# EAGLE design E-Book Wing Rev A (EAGLE 9.4.2)
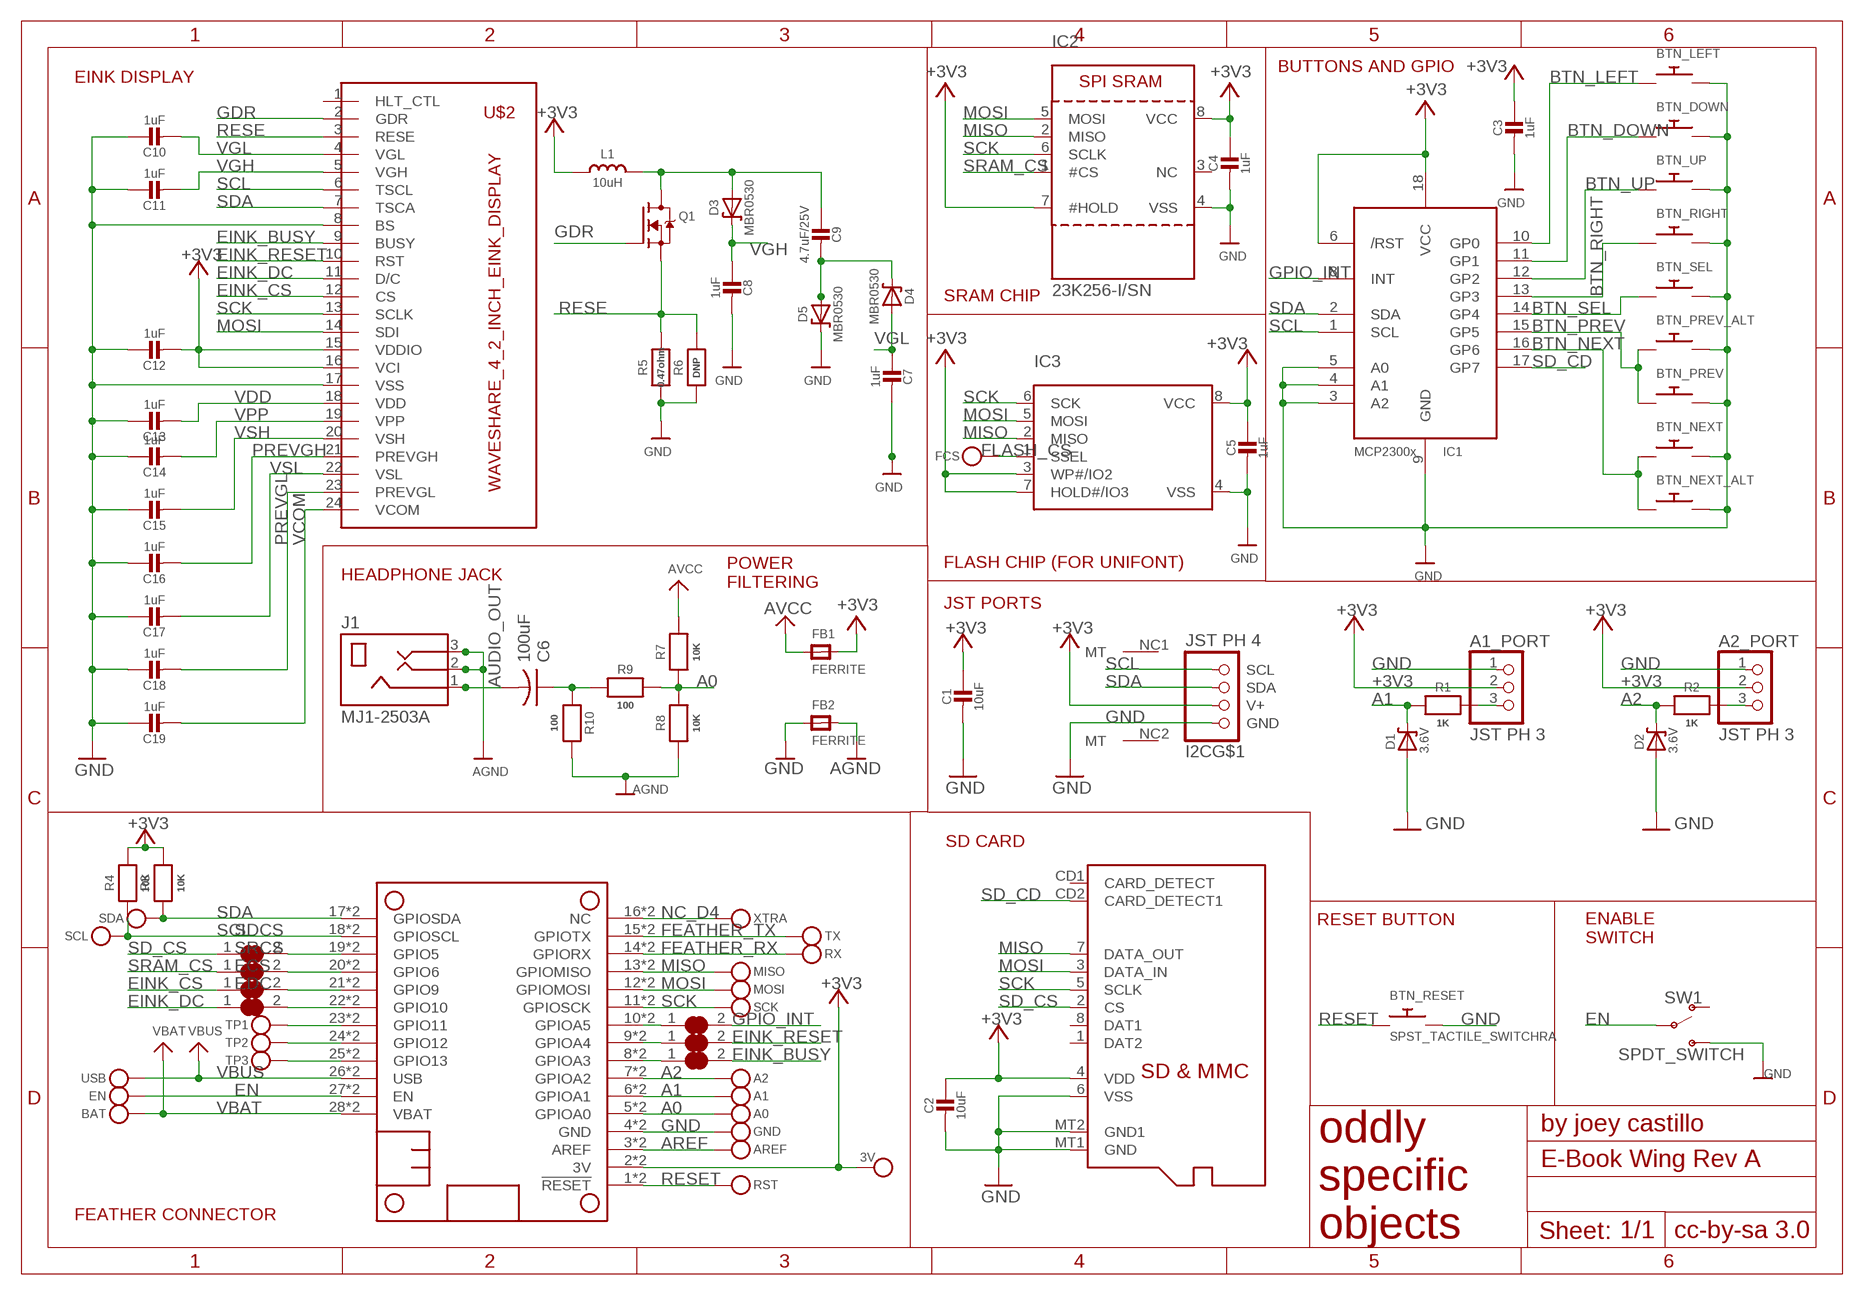
[diagram p0: schematic, sheet 1]

## Parts
3V  MICROBUILDER_TESTPOINT1.5X2.0MM_NOCREAM  [MICROBUILDER_PAD-1.5X2.0]
A0  MICROBUILDER_TESTPOINT1.5X2.0MM_NOCREAM  [MICROBUILDER_PAD-1.5X2.0]
A1  MICROBUILDER_TESTPOINT1.5X2.0MM_NOCREAM  [MICROBUILDER_PAD-1.5X2.0]
A1_PORT  JST PH 3  CON_JST_PH_3PIN  [JSTPH3]
A2  MICROBUILDER_TESTPOINT1.5X2.0MM_NOCREAM  [MICROBUILDER_PAD-1.5X2.0]
A2_PORT  JST PH 3  CON_JST_PH_3PIN  [JSTPH3]
AREF  MICROBUILDER_TESTPOINT1.5X2.0MM_NOCREAM  [MICROBUILDER_PAD-1.5X2.0]
BAT  MICROBUILDER_TESTPOINT1.5X2.0MM_NOCREAM  [MICROBUILDER_PAD-1.5X2.0]
BTN_DOWN  MJTP1250_SPST_SWITCH  [MJTP1250]
BTN_LEFT  MJTP1250_SPST_SWITCH  [MJTP1250]
BTN_NEXT  MJTP1250_SPST_SWITCH  [MJTP1250]
BTN_NEXT_ALT  SPST_TACTILE_SWITCHRA  [TL3330AF130QG]
BTN_PREV  MJTP1250_SPST_SWITCH  [MJTP1250]
BTN_PREV_ALT  SPST_TACTILE_SWITCHRA  [TL3330AF130QG]
BTN_RESET  SPST_TACTILE_SWITCHRA  [TL3330AF130QG]
BTN_RIGHT  MJTP1250_SPST_SWITCH  [MJTP1250]
BTN_SEL  MJTP1250_SPST_SWITCH  [MJTP1250]
BTN_UP  MJTP1250_SPST_SWITCH  [MJTP1250]
C1  10uF  CAP_CERAMIC0805-NOOUTLINE  [0805-NO]
C2  10uF  CAP_CERAMIC0805_10MGAP  [0805_10MGAP]
C3  1uF  CAP_CERAMIC0805_10MGAP  [0805_10MGAP]
C4  1uF  CAP_CERAMIC0805_10MGAP  [0805_10MGAP]
C5  1uF  CAP_CERAMIC0805_10MGAP  [0805_10MGAP]
C6  100uF  C-USC1210  [C1210]
C7  1uF  CAP_CERAMIC0805-NOOUTLINE  [0805-NO]
C8  1uF  CAP_CERAMIC0805-NOOUTLINE  [0805-NO]
C9  4.7uF/25V  CAP_CERAMIC0805-NOOUTLINE  [0805-NO]
C10  1uF  CAP_CERAMIC0805-NOOUTLINE  [0805-NO]
C11  1uF  CAP_CERAMIC0805-NOOUTLINE  [0805-NO]
C12  1uF  CAP_CERAMIC0805-NOOUTLINE  [0805-NO]
C13  1uF  CAP_CERAMIC0805-NOOUTLINE  [0805-NO]
C14  1uF  CAP_CERAMIC0805-NOOUTLINE  [0805-NO]
C15  1uF  CAP_CERAMIC0805-NOOUTLINE  [0805-NO]
C16  1uF  CAP_CERAMIC0805-NOOUTLINE  [0805-NO]
C17  1uF  CAP_CERAMIC0805-NOOUTLINE  [0805-NO]
C18  1uF  CAP_CERAMIC0805-NOOUTLINE  [0805-NO]
C19  1uF  CAP_CERAMIC0805-NOOUTLINE  [0805-NO]
D1  3.6V  DIODE-ZENERSOD123  [SOD-123]
D2  3.6V  DIODE-ZENERSOD123  [SOD-123]
D3  MBR0530  DIODE-SCHOTTKYSOD-123  [SOD-123]
D4  MBR0530  DIODE-SCHOTTKYSOD-123  [SOD-123]
D5  MBR0530  DIODE-SCHOTTKYSOD-123  [SOD-123]
EBSY  MICROBUILDER_SOLDERJUMPER_CLOSED  [MICROBUILDER_SOLDERJUMPER_CLOSEDWIRE]
ECS  MICROBUILDER_SOLDERJUMPER_CLOSED  [MICROBUILDER_SOLDERJUMPER_CLOSEDWIRE]
EDC  MICROBUILDER_SOLDERJUMPER_CLOSED  [MICROBUILDER_SOLDERJUMPER_CLOSEDWIRE]
EN  MICROBUILDER_TESTPOINT1.5X2.0MM_NOCREAM  [MICROBUILDER_PAD-1.5X2.0]
ERST  MICROBUILDER_SOLDERJUMPER_CLOSED  [MICROBUILDER_SOLDERJUMPER_CLOSEDWIRE]
FB1  FERRITE  FERRITE0805  [0805]
FB2  FERRITE  FERRITE0805  [0805]
FCS  MICROBUILDER_TESTPOINTPAD1MM  [MICROBUILDER_TESTPOINT_PAD_1MM]
GND  MICROBUILDER_TESTPOINT1.5X2.0MM_NOCREAM  [MICROBUILDER_PAD-1.5X2.0]
I2C  JST PH 4  STEMMA_I2C_RASMT  [JSTPH4]
IC1  MCP23008/SO  [SO18W]
IC2  23K256-I/SN  SRAM_SPI_SOIC8  [SOIC8_150MIL]
IC3  MICROBUILDER_SPIFLASH_SOIC8  [MICROBUILDER_SOIC8_150MIL]
INT  MICROBUILDER_SOLDERJUMPER_CLOSED  [MICROBUILDER_SOLDERJUMPER_CLOSEDWIRE]
J1  MJ1-2503A  [CUI_MJ1-2503A]
L1  10uH  INDUCTORNR401  [INDUCTOR_4X4MM_NR401]
MICROSD  MICROSD  [MICROSD]
MISO  MICROBUILDER_TESTPOINT1.5X2.0MM_NOCREAM  [MICROBUILDER_PAD-1.5X2.0]
MOSI  MICROBUILDER_TESTPOINT1.5X2.0MM_NOCREAM  [MICROBUILDER_PAD-1.5X2.0]
MS1  MICROBUILDER_FEATHERWING_SMTDUAL  [MICROBUILDER_FEATHERWING_SMT2]
Q1  IRLML0100  IRLML2060TRPBF  [SOT23-3]
R1  1K  RESISTOR_0805MP  [_0805MP]
R2  1K  RESISTOR_0805MP  [_0805MP]
R3  10K  RESISTOR_0805MP  [_0805MP]
R4  10K  RESISTOR_0805MP  [_0805MP]
R5  0.47ohm  RESISTOR0805_10MGAP  [0805_10MGAP]
R6  DNP  RESISTOR0805_10MGAP  [0805_10MGAP]
R7  10K  RESISTOR_0805MP  [_0805MP]
R8  10K  RESISTOR_0805MP  [_0805MP]
R9  100  RESISTOR_0805MP  [_0805MP]
R10  100  RESISTOR_0805MP  [_0805MP]
RST  MICROBUILDER_TESTPOINT1.5X2.0MM_NOCREAM  [MICROBUILDER_PAD-1.5X2.0]
RX  MICROBUILDER_TESTPOINT1.5X2.0MM_NOCREAM  [MICROBUILDER_PAD-1.5X2.0]
SCK  MICROBUILDER_TESTPOINT1.5X2.0MM_NOCREAM  [MICROBUILDER_PAD-1.5X2.0]
SCL  MICROBUILDER_TESTPOINT1.5X2.0MM_NOCREAM  [MICROBUILDER_PAD-1.5X2.0]
SDA  MICROBUILDER_TESTPOINT1.5X2.0MM_NOCREAM  [MICROBUILDER_PAD-1.5X2.0]
SDCS  MICROBUILDER_SOLDERJUMPER_CLOSED  [MICROBUILDER_SOLDERJUMPER_CLOSEDWIRE]
SRCS  MICROBUILDER_SOLDERJUMPER_CLOSED  [MICROBUILDER_SOLDERJUMPER_CLOSEDWIRE]
SW1  SPDT_SWITCH  [A10767]
TP1  MICROBUILDER_TESTPOINT1.5X2.0MM_NOCREAM  [MICROBUILDER_PAD-1.5X2.0]
TP2  MICROBUILDER_TESTPOINT1.5X2.0MM_NOCREAM  [MICROBUILDER_PAD-1.5X2.0]
TP3  MICROBUILDER_TESTPOINT1.5X2.0MM_NOCREAM  [MICROBUILDER_PAD-1.5X2.0]
TX  MICROBUILDER_TESTPOINT1.5X2.0MM_NOCREAM  [MICROBUILDER_PAD-1.5X2.0]
U$2  WAVESHARE_4_2_INCH_EINK_DISPLAY  [EINK_DISPLAY_4_2IN]
USB  MICROBUILDER_TESTPOINT1.5X2.0MM_NOCREAM  [MICROBUILDER_PAD-1.5X2.0]
XTRA  MICROBUILDER_TESTPOINT1.5X2.0MM_NOCREAM  [MICROBUILDER_PAD-1.5X2.0]

## Nets
+3V3: 3V.P$1 A1_PORT.2 A2_PORT.2 C1.1 C2.1 C3.1 C4.1 C5.1 C12.2 FB1.2 I2C.2(V+) IC1.6(/RST) IC1.18(VCC) IC2.7(#HOLD) IC2.8(VCC) IC3.3(WP#/IO2) IC3.7(HOLD#/IO3) IC3.8(VCC) L1.P$2 MICROSD.4(VDD) MS1.2'(3V) MS1.2(3V) R3.1 R4.1 U$2.15(VDDIO) U$2.16(VCI)
_EINK_BUSY: EBSY.1 MS1.8'(GPIOA3) MS1.8(GPIOA3)
_EINK_CS: ECS.2 MS1.21'(GPIO9) MS1.21(GPIO9)
_EINK_DC: EDC.2 MS1.22'(GPIO10) MS1.22(GPIO10)
_EINK_RESET: ERST.1 MS1.9'(GPIOA4) MS1.9(GPIOA4)
_GPIO_INT: INT.1 MS1.10'(GPIOA5) MS1.10(GPIOA5)
_SD_CS: MS1.19'(GPIO5) MS1.19(GPIO5) SDCS.2
_SRAM_CS: MS1.20'(GPIO6) MS1.20(GPIO6) SRCS.2
A0: A0.P$1 MS1.5'(GPIOA0) MS1.5(GPIOA0) R7.2 R8.1 R9.1
A1: A1.P$1 D1.C MS1.6'(GPIOA1) MS1.6(GPIOA1) R1.2
A1_: A1_PORT.3 R1.1
A2: A2.P$1 D2.C MS1.7'(GPIOA2) MS1.7(GPIOA2) R2.2
A2_: A2_PORT.3 R2.1
AGND: FB2.2 J1.2 J1.3 R8.2 R10.1
AREF: AREF.P$1 MS1.3'(AREF) MS1.3(AREF)
AUDIO_OUT: C6.2 J1.1
AVCC: FB1.1 R7.1
BTN_DOWN: BTN_DOWN.P$1 IC1.11(GP1)
BTN_LEFT: BTN_LEFT.P$1 IC1.10(GP0)
BTN_NEXT: BTN_NEXT.P$1 BTN_NEXT_ALT.P$1 IC1.16(GP6)
BTN_PREV: BTN_PREV.P$1 BTN_PREV_ALT.P$1 IC1.15(GP5)
BTN_RIGHT: BTN_RIGHT.P$1 IC1.13(GP3)
BTN_SEL: BTN_SEL.P$1 IC1.14(GP4)
BTN_UP: BTN_UP.P$1 IC1.12(GP2)
EINK_BUSY: EBSY.2 U$2.9(BUSY)
EINK_CS: ECS.1 U$2.12(CS)
EINK_DC: EDC.1 U$2.11(D/C)
EINK_RESET: ERST.2 U$2.10(RST)
EN: EN.P$1 MS1.27'(EN) MS1.27(EN) SW1.P$2(P)
FEATHER_RX: MS1.14'(GPIORX) MS1.14(GPIORX) RX.P$1
FEATHER_TX: MS1.15'(GPIOTX) MS1.15(GPIOTX) TX.P$1
FLASH_CS: FCS.P$1 IC3.1(SSEL)
GDR: Q1.1(G) U$2.2(GDR)
GND: A1_PORT.1 A2_PORT.1 BTN_DOWN.P$2 BTN_LEFT.P$2 BTN_NEXT.P$2 BTN_NEXT_ALT.P$2 BTN_PREV.P$2 BTN_PREV_ALT.P$2 BTN_RESET.P$2 BTN_RIGHT.P$2 BTN_SEL.P$2 BTN_UP.P$2 C1.2 C2.2 C3.2 C4.2 C5.2 C7.2 C8.2 C10.1 C11.1 C12.1 C13.1 C14.1 C15.1 C16.1 C17.1 C18.1 C19.1 D1.A D2.A D5.C FB2.1 GND.P$1 I2C.1(GND) IC1.3(A2) IC1.4(A1) IC1.5(A0) IC1.9(GND) IC2.4(VSS) IC3.4(VSS) MICROSD.6(VSS) MICROSD.MT1(GND) MICROSD.MT2(GND1) MS1.4'(GND) MS1.4(GND) R5.2 R6.2 SW1.P$3(S) U$2.8(BS) U$2.17(VSS)
GPIO_INT: IC1.8(INT) INT.2
MISO: IC2.2(MISO) IC3.2(MISO) MICROSD.7(DATA_OUT) MISO.P$1 MS1.13'(GPIOMISO) MS1.13(GPIOMISO)
MOSI: IC2.5(MOSI) IC3.5(MOSI) MICROSD.3(DATA_IN) MOSI.P$1 MS1.12'(GPIOMOSI) MS1.12(GPIOMOSI) U$2.14(SDI)
N$1: C6.1 R9.2 R10.2
N$2: C9.2 D4.C D5.A
N$3: C9.1 D3.A L1.P$1 Q1.3(D)
N$4: MS1.25'(GPIO13) MS1.25(GPIO13) TP3.P$1
N$5: MS1.24'(GPIO12) MS1.24(GPIO12) TP2.P$1
N$6: MS1.23'(GPIO11) MS1.23(GPIO11) TP1.P$1
NC_D4: MS1.16'(NC) MS1.16(NC) XTRA.P$1
PREVGH: C16.2 U$2.21(PREVGH)
PREVGL: C18.2 U$2.23(PREVGL)
RESE: Q1.2(S) R5.1 R6.1 U$2.3(RESE)
RESET: BTN_RESET.P$1 MS1.1'(!RESET) MS1.1(!RESET) RST.P$1
SCK: IC2.6(SCLK) IC3.6(SCK) MICROSD.5(SCLK) MS1.11'(GPIOSCK) MS1.11(GPIOSCK) SCK.P$1 U$2.13(SCLK)
SCL: I2C.4(SCL) IC1.1(SCL) MS1.18'(GPIOSCL) MS1.18(GPIOSCL) R4.2 SCL.P$1 U$2.6(TSCL)
SD_CD: IC1.17(GP7) MICROSD.CD2(CARD_DETECT1)
SD_CS: MICROSD.2(CS) SDCS.1
SDA: I2C.3(SDA) IC1.2(SDA) MS1.17'(GPIOSDA) MS1.17(GPIOSDA) R3.2 SDA.P$1 U$2.7(TSCA)
SRAM_CS: IC2.1(#CS) SRCS.1
VBAT: BAT.P$1 MS1.28'(VBAT) MS1.28(VBAT)
VBUS: MS1.26'(USB) MS1.26(USB) USB.P$1
VCOM: C19.2 U$2.24(VCOM)
VDD: C13.2 U$2.18(VDD)
VGH: C8.1 C11.2 D3.C U$2.5(VGH)
VGL: C7.1 C10.2 D4.A U$2.4(VGL)
VPP: C14.2 U$2.19(VPP)
VSH: C15.2 U$2.20(VSH)
VSL: C17.2 U$2.22(VSL)
Unconnected: I2C.NC1(MT) I2C.NC2(MT) IC2.3(NC) MICROSD.1(DAT2) MICROSD.8(DAT1) MICROSD.CD1(CARD_DETECT) SW1.P$1(O) U$2.1(HLT_CTL)

## Notes on the sheet
- BUTTONS AND GPIO
- EINK DISPLAY
- SRAM CHIP
- FLASH CHIP (FOR UNIFONT)
- HEADPHONE JACK
- POWER
  FILTERING
- JST PORTS
- SD CARD
- RESET BUTTON
- ENABLE
  SWITCH
- FEATHER CONNECTOR

## Library data of the parts
3V A0 A1 A2 AREF BAT EN FCS GND MISO MOSI RST RX SCK SCL SDA TP1-TP3 TX USB XTRA = Adafruit 3.5in 480x320 FeatherWing:MICROBUILDER_TESTPOINT: Test Point Various test points for characterisation and PCB testing TESTPOINT_SMT - Compact Surface Mount Test Point [Digikey: 5016KTR-ND]
A1_PORT A2_PORT = microbuilder:CON_JST_PH_3PIN
BTN_DOWN BTN_LEFT BTN_NEXT BTN_PREV BTN_RIGHT BTN_SEL BTN_UP = My Stuff:MJTP1250_SPST_SWITCH
BTN_NEXT_ALT BTN_PREV_ALT BTN_RESET = My Stuff:SPST_TACTILE_SWITCH
C1-C5 C7-C19 = microbuilder:CAP_CERAMIC: Ceramic Capacitors For new designs, use the packages preceded by an '_' character since they are more reliable: The following footprints should be used on most boards: _0402 - Standard footprint for regular board layouts _0603 - Standard footprint for regular board layouts _0805 - Standard footprint for regular board layouts _1206 - Standard footprint for regular board layouts For extremely tight-pitch boards where space is at a premium, the following 'micro-pitch' footprints can be used (smaller pads, no silkscreen outline, etc.): _0402MP - Micro-pitch footprint for very dense/compact boards _0603MP - Micro-pitch footprint for very dense/compact boards _0805MP - Micro-pitch footprint for very dense/compact boards _1206MP - Micro-pitch footprint for very dense/compact boards
C6 = resistor:C-US: CAPACITOR, American symbol
D1 D2 = microbuilder:DIODE-ZENER: Zener Diode SMA: 30V 1W Zener Diode, 1.2Vf - Digikey: SMAZ30-FDICT-ND
D3-D5 = microbuilder:DIODE-SCHOTTKY
EBSY ECS EDC ERST INT SDCS SRCS = Adafruit 3.5in 480x320 FeatherWing:MICROBUILDER_SOLDERJUMPER_CLOSED: Solder Jumper - Closed These solder jumpers are closed by default CLOSEDWIRE - 10 mil trace between pads that can be cut and resoldered later CLOSEDPERM - 63 mil trace between pads for a permanent connection (used to 'bridge' two signals, a shameless hack for Eagle). Can double as a test point as well (no cream layer)
FB1 FB2 = microbuilder:FERRITE: Ferrite Bead 0603 MMZ1608B121C - 120 Ohm @ 100MHz, 600mA, 0.15 Ohm DC Resistance - Digikey: 445-2164-1-ND BK1608HW121-T - 120 Ohm, 600mA Ferrite Chip - Digikey: 587-1876-2-ND 0805 HZ0805B272R-10 - 2.7K Ohm @ 100MHz, 200mA, 0.8 Ohm DC Resistance - Digikey: 240-2504-1-ND (see also Murata BLM21BD272SN1L) MMZ2012Y152B - 1.5K Ohm @ 100MHz, 500mA, 0.4 Ohm DC Resistance - Digikey: 445-1560-1-ND - Mainly for high frequency (80-400MHz) MMZ2012R102A - 1K Ohm @ 100MHz, 500mA, 0.3 Ohm DC Resistance - Digikey: 445-1555-2-ND - More general purpose (10-200MHz)
I2C = microbuilder:STEMMA_I2C
IC1 = My Stuff:MCP23008: MCP23008 Inexpensive i2c i/o expander - 8 general purpose i/o pins with optional pullups
IC2 = microbuilder:SRAM_SPI_SOIC8: SRAM - 8-Pin SPI Interface 23K640-I/SN - 8KB (64Kb), 20MHz, 2.7-3.6V 23K256-I/SN - 32KB (256Kb), 20MHz, 2.7-3.6V 23LC512-I/SN - 64KB (512Kb), 20MHz, 2.7-3.6V
IC3 = Adafruit Feather M0 Express:MICROBUILDER_SPIFLASH_SOIC8: SOIC8 SPI Flash Be careful with the size since SOIC8 flash comes in several 'widths' SOIC8 150 mil M25P16 - 16Mbit (2Mbit x 8) Serial Flash (75MHz SPI Bus), Supply: 2.7-3.6V Digikey: SOIC8 - M25P16-VMN6P-ND SOIC8 208 mil W25Q16BVSSIG - 16Mbit (2Mbit x 8) Serial Flash (104MHz SPI Bus), Supply: 2.7-3.6V Digikey: SOIC8 - W25Q16BVSSIG-ND
J1 = My Stuff:MJ1-2503A: 2.5 mm, Mono, Right Angle, Through Hole, Audio Jack Connector; CUI_PURCHASE_URL: https://www.cui.com/product/interconnect/connectors/audio-connectors/jacks/mj1-2503a?utm_source=snapeda.com&utm_medium=referral&utm_campaign=snapedaBOM; DESCRIPTION: 2.5 mm, Mono, Right Angle, Through Hole, Audio Jack Connector; DIGI-KEY_PART_NUMBER: CP1-2503AM-ND; DIGI-KEY_PURCHASE_URL: https://www.digikey.com/product-detail/en/cui-inc/MJ1-2503A/CP1-2503AM-ND/738679?utm_source=snapeda&utm_medium=aggregator&utm_campaign=symbol; MF: CUI Inc.; MP: MJ1-2503A; PACKAGE: None
L1 = microbuilder:INDUCTOR: Inductors 0603: 10nH Ceramic Inductor - microwire antenna/RF (Digikey: 712-1434-2-ND) 0805: 560nH Ceramic Inductor - RF (Digikey: 553-1047-1-ND) 270nH Ceramic Inductor - Q = 40@250MHz, +-5%, 1 Ohm DC Resistance (Digikey: 535-10506-2-ND) 1007 (2518 Metric) SMT: 10µH 10% 250mOhm 820mA 1007 Inductor (Digikey: 587-2189-1-ND) 22µH 10% 500mOhm 580mA 1007 Inductor (Digikey: 587-2190-1-ND) 47µH 10% 950mOhm 420mA 1007 Inductor (Digikey: 587-2191-1-ND) 47µH 5% 100mOhm 1A 1008 Inductor (Digikey: 732-1816-1-ND) 5.0x5.0mm (Taiyo Yuden NR5040 Series) 6.8µH 20% 2.3A 64mOhm Inductor (Digikey: 587-2374-2-ND) 5.0x5.0mm (TDK VLC5045 Series) 4.7µH 20% 3.3A 34mOhm Inductor (Digikey: 445-6526-1-ND) 6.8µH 20% 2.7A 46mOhm Inductor (Digikey: 445-6527-1-ND) 6.0x6.0mm (TDK VLC6045 Series) 4.7µH 20% 3.8A 27mOhm Inductor (Digikey: 445-6538-2-ND) 6.8µH 20% 3A 41mOhm Inductor (Digikey: 445-6540-1-ND) 6.2µH 30% 2.2A 45mOhm Inductor (Digikey: SRR5028-6R2YCT-ND) - Not TDK VLC6045 but footprint should match 6.0x6.0mm (TDK SLF6045 Series) 6.8uH 30% 2A 33mOhm Inductor (Digikey: 445-4572-1-ND, Mouser: 810-SLF645T6R8N2R0PF) 6.0x6.0mm (Sumida CDRH5D28 Series) 6.2uH 30% 1.8A 45mOhm Inductor (Digikey: 308-1542-1-ND) Taiyo Yuden NR3015T2R2M - 2.2uH 20% 1.5A (Digikey: 587-1648-2-ND, Mouser: 963-NR3015T2R2M) - Used with TI TPS62172 CoilCraft RFID Transponder Coil - MA5532-AE (For use with AS3935 Lightning Sensor) Taiyo Yuden NRH2412T2R2MNGH - 2.2uH 20% 1AA (Digikey: 587-3443-1-ND) - Used with TI LM3671 Vishay IHLP 1.0uH Molded Inductor - 24mOhm DCR, 5A, +/-20%, -55°C-125°C (Digikey: 541-1319-1-ND)
MICROSD = adafruit:MICROSD: Micro-SD / Transflash card holder with SPI pinout For the 3M # 2908-05WB-MG and/or 4UCON #19656 push-push type
MS1 = My Stuff:MICROBUILDER_FEATHERWING
Q1 = Parts:IRLML2060TRPBF
R1-R10 = microbuilder:RESISTOR: Resistors For new designs, use the packages preceded by an '_' character since they are more reliable: The following footprints should be used on most boards: _0402 - Standard footprint for regular board layouts _0603 - Standard footprint for regular board layouts _0805 - Standard footprint for regular board layouts _1206 - Standard footprint for regular board layouts For extremely tight-pitch boards where space is at a premium, the following 'micro-pitch' footprints can be used (smaller pads, no silkscreen outline, etc.): _0402MP - Micro-pitch footprint for very dense/compact boards _0603MP - Micro-pitch footprint for very dense/compact boards _0805MP - Micro-pitch footprint for very dense/compact boards _1206MP - Micro-pitch footprint for very dense/compact boards
SW1 = My Stuff:SPDT_SWITCH
U$2 = My Stuff:WAVESHARE_4_2_INCH_EINK_DISPLAY

## Net classes
1 power: width 0.305 mm

## Board
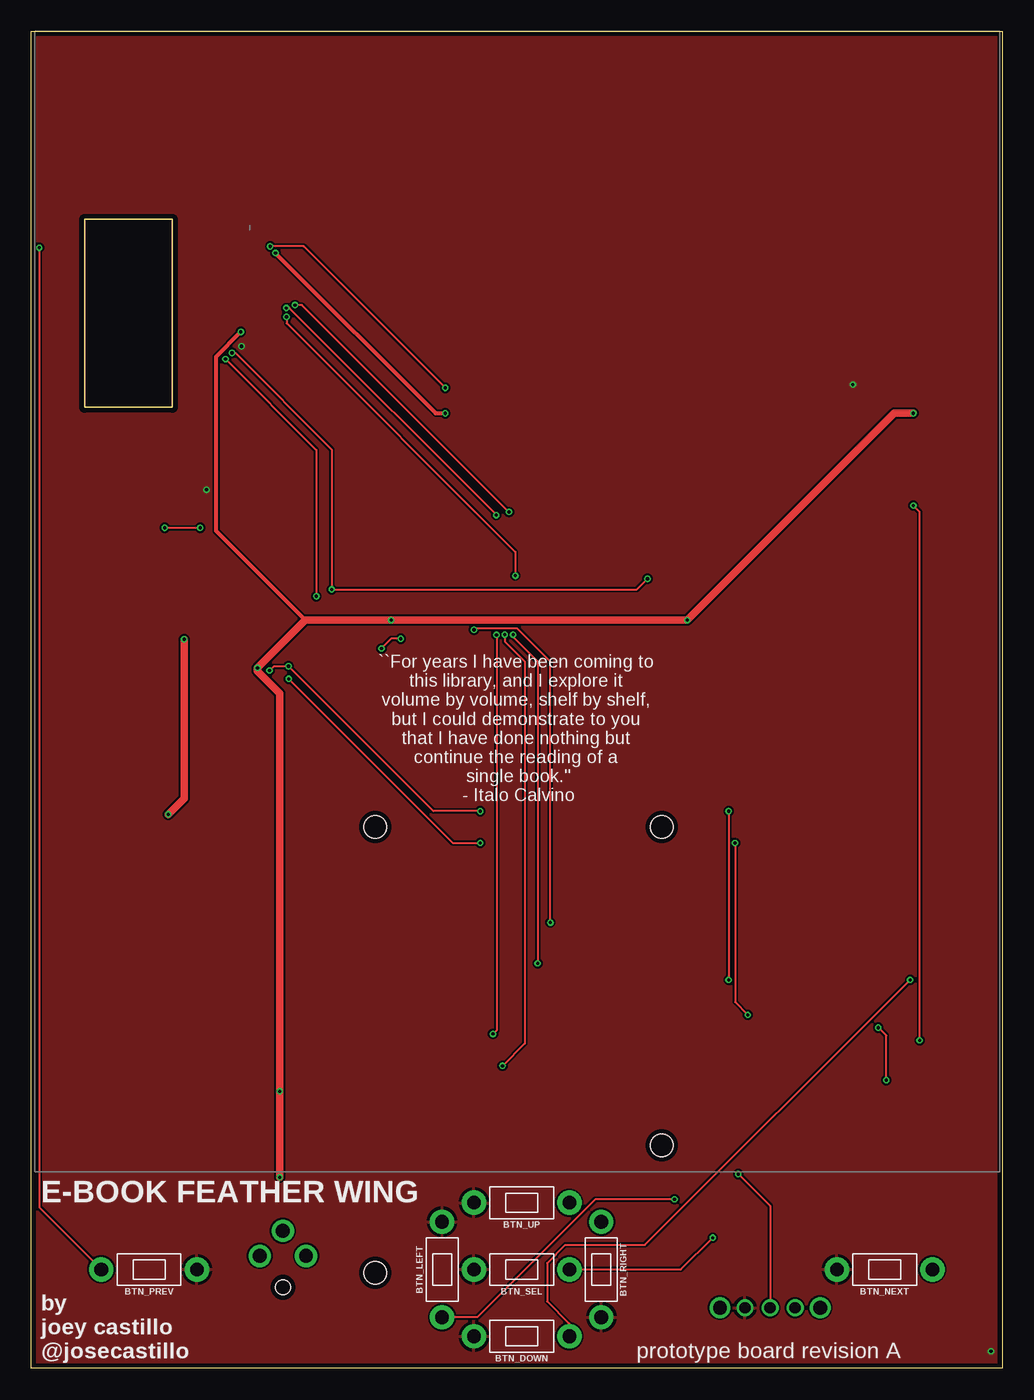
[diagram p1: board, top side]
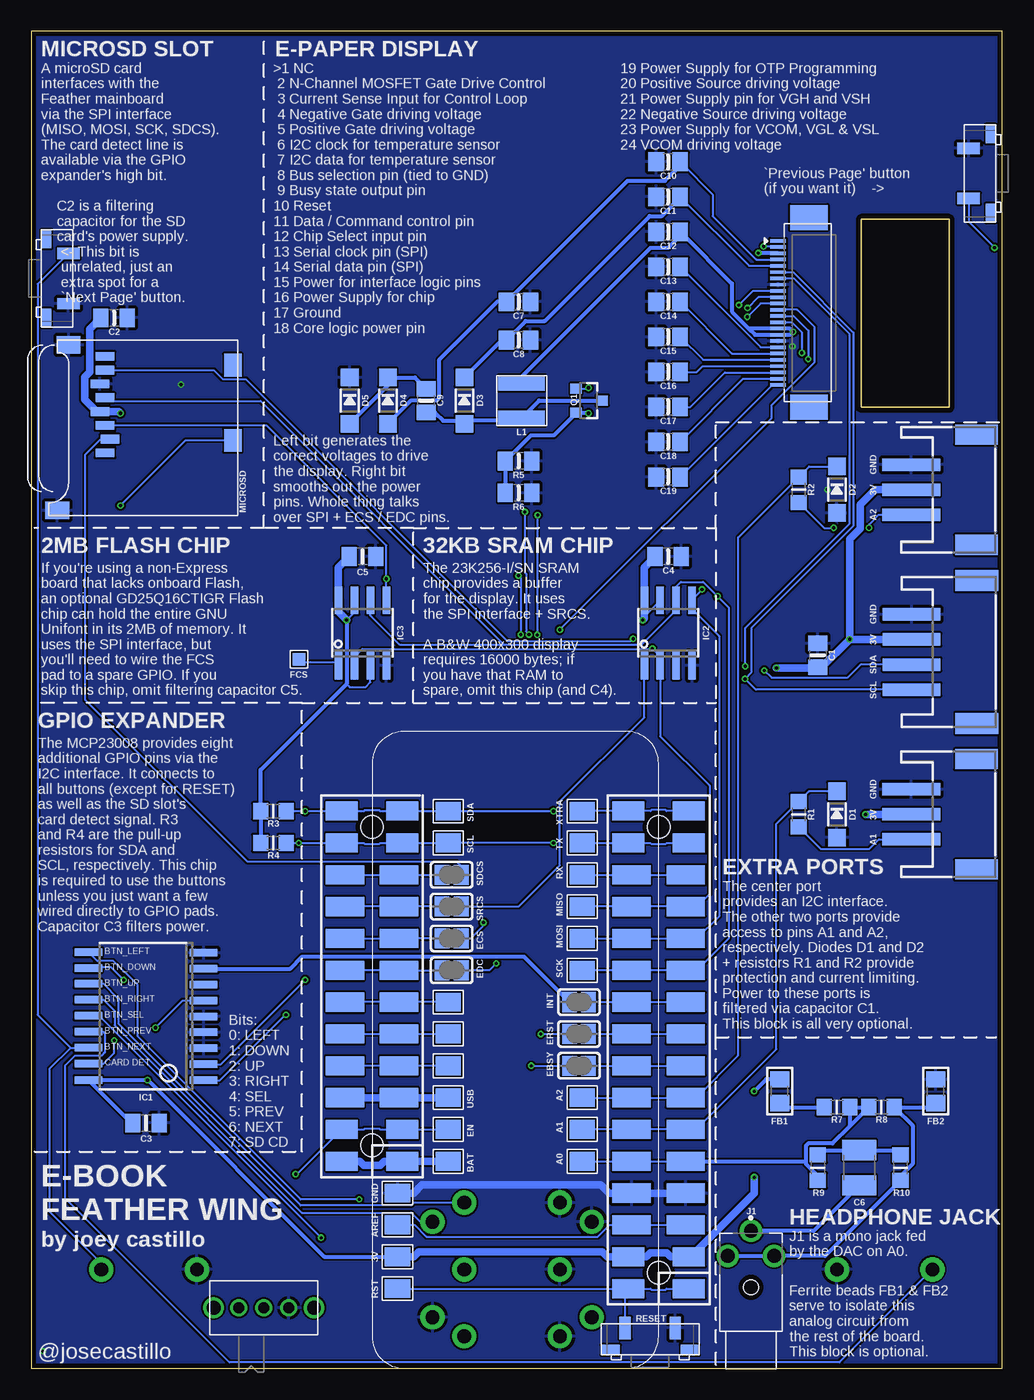
[diagram p2: board, bottom side, seen from below]

Size 77.47 x 106.68 mm. Coordinates in mm from the lower left corner, seen from the top.
Outline: 0,106.68 77.47,106.68 77.47,0 0,0 0,106.68
Copper layers (1*16): Top 0.035559375mm / dielectric 1.6mm / Bottom 0.035559375mm
Design rules "oshpark-2layer *": minimum track width 6mil, minimum drill 10mil, track to track 6mil, track to pad 6mil, pad to pad 6mil, via to via 6mil, smd to smd 6mil, copper to edge 15mil, drill to drill 6mil, minimum pad ring 5mil, minimum via ring 5mil, stop-mask expansion 2.5mil, vias tented up to drill 10mil, thermal gap 10mil

### Footprints (pad centres in the part's own frame; a part is rotated, then mirrored left to right if it is on the bottom)
MICROBUILDER_PAD-1.5X2.0 = smd 1.5 x 2: P$1 0,0
JSTPH3 = smd 1 x 4.6: 1 -2,-2.7; 2 0,-2.7; 3 2,-2.7 | smd 1.6 x 3.4: NC1 -4.4,2.5; NC2 4.4,2.5
MJTP1250 = drill 1.1 pad 1.93: P$1 -2.54,0; P$2 5.08,0
TL3330AF130QG = smd 1.45 x 0.8: MP1 0.75,-2.1; MP2 7.05,-2.1 | smd 0.9 x 1.778: P$1 1.9,-0.346; P$2 5.9,-0.346
0805-NO = smd 1.24 x 1.5: 1 -0.95,0; 2 0.95,0
0805_10MGAP = smd 1.2 x 1.5: 1 -1.05,0; 2 1.05,0
C1210 = smd 1.6 x 2.7: 1 -1.4,0; 2 1.4,0
SOD-123 = smd 1.4 x 1.4: A 1.85,0; C -1.85,0
MICROBUILDER_SOLDERJUMPER_CLOSEDWIRE = smd 1.168 x 1.6: 1 -0.762,0; 2 0.762,0 | smd 0.635 x 0.203: WIRE 0,0
0805 = smd 1.3 x 1.5: 1 -0.95,0; 2 0.95,0
MICROBUILDER_TESTPOINT_PAD_1MM = smd 1 x 1: P$1 0,0
JSTPH4 = smd 1 x 4.6: 1 -3,-3.7; 2 -1,-3.7; 3 1,-3.7; 4 3,-3.7 | smd 1.7 x 3.4: NC1 -5.7,1.5; NC2 5.7,1.5
SO18W = smd 0.6 x 2.2: 1 -4.445,-4.6; 2 -3.175,-4.6; 3 -1.905,-4.6; 4 -0.635,-4.6; 5 0.635,-4.6; 6 1.905,-4.6; 7 3.175,-4.6; 8 4.445,-4.6; 9 5.715,-4.6; 10 5.775,4.6; 11 4.505,4.6; 12 3.235,4.6; 13 1.965,4.6; 14 0.695,4.6; 15 -0.575,4.6; 16 -1.845,4.6; 17 -3.145,4.6; 18 -4.445,4.6
SOIC8_150MIL = smd 0.6 x 2.2: 1 -1.905,-2.6; 2 -0.635,-2.6; 3 0.635,-2.6; 4 1.905,-2.6; 5 1.905,2.6; 6 0.635,2.6; 7 -0.635,2.6; 8 -1.905,2.6
MICROBUILDER_SOIC8_150MIL = smd 0.6 x 2.2: 1 -1.905,-2.6; 2 -0.635,-2.6; 3 0.635,-2.6; 4 1.905,-2.6; 5 1.905,2.6; 6 0.635,2.6; 7 -0.635,2.6; 8 -1.905,2.6
CUI_MJ1-2503A = drill 1.1 pad 1.778: 1 -4.1,0; 2 -2.1,1.85; 3 -2.1,-1.85 | hole 1.2: 0.4,0
INDUCTOR_4X4MM_NR401 = smd 1.2 x 3.7: P$1 -1.4,0; P$2 1.4,0
MICROSD = smd 0.7 x 1.5: 1 9,-10.64; 2 7.9,-10.24; 3 6.8,-10.64; 4 5.7,-11.04; 5 4.6,-10.64; 6 3.5,-11.04; 7 2.4,-10.64; 8 1.3,-10.64 | smd 1.8 x 1.4: CD1 2,-0.44; CD2 8,-0.44 | smd 1.4 x 1.9: MT1 0.4,-13.54; MT2 13.6,-14.44
MICROBUILDER_FEATHERWING_SMT2 = smd 1.524 x 2.54: 1 6.35,2.413; 1' 6.35,-2.413; 2 8.89,2.413; 2' 8.89,-2.413; 15 41.91,2.413; 15' 41.91,-2.413; 16 44.45,2.413; 16' 44.45,-2.413; 17 44.45,20.447; 17' 44.45,25.273; 18 41.91,20.447; 18' 41.91,25.273; 27 19.05,20.447; 27' 19.05,25.273; 28 16.51,20.447; 28' 16.51,25.273 | smd 1.524 x 3.048: 3 11.43,2.159; 3' 11.43,-2.159; 4 13.97,2.159; 4' 13.97,-2.159; 5 16.51,2.159; 5' 16.51,-2.159; 6 19.05,2.159; 6' 19.05,-2.159; 7 21.59,2.159; 7' 21.59,-2.159; 8 24.13,2.159; 8' 24.13,-2.159; 9 26.67,2.159; 9' 26.67,-2.159; 10 29.21,2.159; 10' 29.21,-2.159; 11 31.75,2.159; 11' 31.75,-2.159; 12 34.29,2.159; 12' 34.29,-2.159; 13 36.83,2.159; 13' 36.83,-2.159; 14 39.37,2.159; 14' 39.37,-2.159; 19 39.37,20.701; 19' 39.37,25.019; 20 36.83,20.701; 20' 36.83,25.019; 21 34.29,20.701; 21' 34.29,25.019; 22 31.75,20.701; 22' 31.75,25.019; 23 29.21,20.701; 23' 29.21,25.019; 24 26.67,20.701; 24' 26.67,25.019; 25 24.13,20.701; 25' 24.13,25.019; 26 21.59,20.701; 26' 21.59,25.019 | hole 1.8: 17.78,22.86; 43.18,22.86; 7.62,0; 43.18,0
SOT23-3 = smd 0.8 x 0.9: 1 -0.95,-1; 2 0.95,-1; 3 0,1.1
_0805MP = smd 1.2 x 1.3: 1 -1.016,0; 2 1.016,0
A10767 = drill 1.1: MP1 -4,0; MP2 4,0 | drill 0.9: P$1 -2,0; P$2 0,0; P$3 2,0
EINK_DISPLAY_4_2IN = smd 1.25 x 0.275 bottom: 1 17.653,-16.717; 2 17.653,-17.217; 3 17.653,-17.717; 4 17.653,-18.217; 5 17.653,-18.717; 6 17.653,-19.217; 7 17.653,-19.717; 8 17.653,-20.217; 9 17.653,-20.717; 10 17.653,-21.217; 11 17.653,-21.717; 12 17.653,-22.217; 13 17.653,-22.717; 14 17.653,-23.217; 15 17.653,-23.717; 16 17.653,-24.217; 17 17.653,-24.717; 18 17.653,-25.217; 19 17.653,-25.717; 20 17.653,-26.217; 21 17.653,-26.717; 22 17.653,-27.217; 23 17.653,-27.717; 24 17.653,-28.217 | smd 3 x 2 bottom: SPRT1 15.193,-14.867; SPRT2 15.193,-29.977

### Placement (x,y rotation side)
3V  48.26,8.89 270 bottom
A0  33.53,16.51 270 bottom
A1  33.53,19.05 270 bottom
A1_PORT  4.57,44.2 270 bottom
A2  33.53,21.59 270 bottom
A2_PORT  4.57,70.1 270 bottom
AREF  48.26,11.43 90 bottom
BAT  44.2,16.51 270 bottom
BTN_DOWN  40.39,2.54 180 top
BTN_LEFT  32.77,6.6 90 top
BTN_NEXT  69.34,7.87 180 top
BTN_NEXT_ALT  74.17,90.86 270 bottom
BTN_PREV  8.13,7.87 0 top
BTN_PREV_ALT  3.05,91.44 90 bottom
BTN_RESET  32,3.56 0 bottom
BTN_RIGHT  45.47,9.14 270 top
BTN_SEL  40.39,7.87 180 top
BTN_UP  40.39,13.21 180 top
C1  14.73,56.9 90 bottom
C2  70.87,83.82 0 bottom
C3  68.33,19.56 0 bottom
C4  26.67,64.77 0 bottom
C5  51.05,64.77 0 bottom
C6  11.43,16 270 bottom
C7  38.61,85.09 0 bottom
C8  38.61,82.04 0 bottom
C9  45.97,77.22 90 bottom
C10  26.67,96.27 0 bottom
C11  26.67,93.47 0 bottom
C12  26.67,90.68 0 bottom
C13  26.67,87.88 0 bottom
C14  26.67,85.09 0 bottom
C15  26.67,82.3 0 bottom
C16  26.67,79.5 0 bottom
C17  26.67,76.71 0 bottom
C18  26.67,73.91 0 bottom
C19  26.67,71.12 0 bottom
D1  13.21,44.2 270 bottom
D2  13.21,70.1 270 bottom
D3  42.93,77.22 270 bottom
D4  49.02,77.22 270 bottom
D5  52.07,77.22 270 bottom
EBSY  33.78,24.13 180 bottom
ECS  43.94,34.29 180 bottom
EDC  43.94,31.75 180 bottom
EN  44.2,19.05 270 bottom
ERST  33.78,26.67 180 bottom
FB1  17.78,22.1 90 bottom
FB2  5.33,22.1 270 bottom
FCS  56.13,56.59 180 bottom
GND  48.26,13.97 90 bottom
I2C  3.56,57.15 270 bottom
IC1  68.33,27.43 90 bottom
IC2  26.67,58.67 0 bottom
IC3  51.05,58.67 0 bottom
INT  33.78,29.21 180 bottom
J1  20.07,6.86 270 bottom
L1  38.35,77.22 90 bottom
MICROSD  60.96,82.04 270 bottom
MISO  33.53,36.83 270 bottom
MOSI  33.53,34.29 270 bottom
MS1  27.43,0 90 bottom
Q1  33.02,77.22 270 bottom
R1  16.26,44.2 90 bottom
R2  16.26,70.1 90 bottom
R3  58.17,44.45 0 bottom
R4  58.17,41.91 0 bottom
R5  38.61,72.39 0 bottom
R6  38.61,69.85 0 bottom
R7  13.21,20.83 0 bottom
R8  9.65,20.83 0 bottom
R9  14.73,16 90 bottom
R10  8.13,16 90 bottom
RST  48.26,6.35 90 bottom
RX  33.53,39.37 270 bottom
SCK  33.53,31.75 270 bottom
SCL  44.2,41.91 270 bottom
SDA  44.2,44.45 270 bottom
SDCS  43.94,39.37 180 bottom
SRCS  43.94,36.83 180 bottom
SW1  58.93,4.83 0 bottom
TP1  44.2,29.21 270 bottom
TP2  44.2,26.67 270 bottom
TP3  44.2,24.13 270 bottom
TX  33.53,41.91 270 bottom
U$2  0.25,106.68 0 top
USB  44.2,21.59 270 bottom
XTRA  33.53,44.45 270 bottom

### Tracks (layer width: path | path; a pad name or v marks a point on that pad's centre or on a via)
+3V3  (via drill 0.25)
  Top 0.152: v68.2,22.99 68.2,26.54 v67.56,27.18
  Top 0.305: 21.84,59.69 14.73,66.8 14.73,80.72 v16.71,82.7
  Top 0.61: v70.36,76.2 68.83,76.2 v52.32,59.69 v28.7,59.69 21.84,59.69 v18.03,55.88 18.03,55.63 19.81,53.85 v19.81,22.1 v19.81,15.24 | v12.19,58.17 12.19,45.47 v10.92,44.2
  Bottom 0.152: v52.32,59.69 51.69,60.33 IC3.7 | 52.32,54.61 52.07,54.36 50.8,54.36 50.42,54.74 IC3.3 | IC2.7 28.7,59.88 v28.7,59.69 | v67.56,27.18 65.41,29.34 IC1.6
  Bottom 0.305: C12.2 25.56,90.52 | 25.56,90.52 21.59,86.55 21.59,84.33 20.23,82.96 | 20.23,82.96 19.73,82.46 U$2.16 16.95,82.46 v16.71,82.7 16.97,82.96 U$2.15 20.23,82.96 | L1.P$2 38.35,79.12 28.07,89.41 26.67,89.41 25.56,90.52 | 3V.P$1 54.1,8.89 v68.2,22.99 IC1.18 69.5,19.56 C3.1 | v52.32,59.69 52.32,54.61 59.18,47.75 R3.1 R4.1 | FB1.2 18.86,23.05 v19.81,22.1
  Bottom 0.61: v28.7,59.69 28.58,59.82 IC2.8 28.58,61.28 28.58,63.91 C4.1 | v52.32,59.69 52.96,60.33 IC3.8 52.97,61.28 52.97,63.91 C5.1 | v70.36,76.2 70.48,76.33 71.98,76.33 MICROSD.4 72.04,76.38 72.29,76.38 73.21,77.3 73.21,79.08 72.81,79.48 72.81,82.93 C2.1 | v18.03,55.88 14.8,55.88 C1.1 14.41,55.95 v12.19,58.17 | v10.92,44.2 A1_PORT.2 | I2C.2 7.27,58.17 v12.19,58.17 | 3V.P$1 46.97,8.89 46.56,9.3 31.92,9.3 31.52,8.89 MS1.2 28.41,8.89 28.09,9.21 26.78,9.21 26.46,8.89 MS1.2' 24.88,8.89 19.81,13.96 v19.81,15.24 | v12.19,58.17 12.19,66.16 11.35,66.99 11.35,68.91 10.16,70.1 A2_PORT.2
_EINK_BUSY
  Bottom 0.152: EBSY.1 MS1.8 MS1.8'
_EINK_CS
  Bottom 0.152: MS1.21' MS1.21 ECS.2
_EINK_DC
  Bottom 0.152: MS1.22' MS1.22 EDC.2
_EINK_RESET
  Bottom 0.152: ERST.1 MS1.9 MS1.9'
_GPIO_INT
  Bottom 0.152: INT.1 MS1.10 MS1.10'
_SD_CS
  Bottom 0.152: MS1.19' MS1.19 SDCS.2
_SRAM_CS
  Bottom 0.152: SRCS.2 MS1.20 MS1.20'
A0
  Bottom 0.152: A0.P$1 MS1.5 MS1.5'
  Bottom 0.305: 15.69,16.51 15.69,17.74 15.51,17.92 13.57,17.92 12.19,19.3 | 15.69,16.51 15.69,16.29 14.73,15.34 R9.1 | 12.19,19.3 R8.1 R7.2 12.19,19.3 | MS1.5' 15.69,16.51
A1
  Bottom 0.152: A1.P$1 MS1.6 MS1.6' 24.44,19.05 18.03,25.46 18.03,43.43 R1.2 15.42,46.05 D1.C
A1_
  Bottom 0.152: A1_PORT.3 9.86,42.2 10.63,41.42 14.49,41.42 R1.1
A2
  Bottom 0.152: A2.P$1 MS1.7 MS1.7' 24.44,21.59 21.08,24.95 21.08,66.29 R2.2 15.42,71.95 D2.C
A2_  (via drill 0.25)
  Top 0.152: v13.46,67.06 v10.64,67.06
  Bottom 0.152: R2.1 14.22,67.06 v13.46,67.06 | v10.64,67.06 10.64,67.33 9.87,68.1 A2_PORT.3
AGND
  Bottom 0.305: FB2.2 5.65,20.83 R8.2 7.17,19.36 7.17,16.29 8.13,15.34 R10.1 14.16,8.96 J1.2 J1.3
AREF
  Bottom 0.152: MS1.3' 29.46,11.43 MS1.3 31.33,11.43 32.27,10.49 45.96,10.49 46.9,11.43 AREF.P$1
AUDIO_OUT
  Bottom 0.305: C6.2 15.07,10.96 J1.1
AVCC
  Bottom 0.305: FB1.1 17.46,20.83 R7.1
BTN_DOWN  (via drill 0.25)
  Top 0.152: BTN_DOWN.P$1 42.93,3.56 41.15,5.33 41.15,8.38 42.6,9.83 48.95,9.83 v70.1,30.99
  Bottom 0.152: IC1.11 72.86,32 71.12,32 v70.1,30.99
BTN_LEFT  (via drill 0.25)
  Top 0.152: v51.31,13.47 44.97,13.47 35.56,4.06 BTN_LEFT.P$1
  Bottom 0.152: v51.31,13.47 55.99,13.47 69,26.49 69,30.57 70.92,32.49 72.21,32.49 IC1.10
BTN_NEXT
  Bottom 0.152: BTN_NEXT_ALT.P$1 76.96,86.51 76.96,28.19 74.35,25.58 | 74.35,25.58 72.94,25.58 IC1.16 | BTN_NEXT.P$1 71.88,8.38 76,12.5 76,23.93 74.35,25.58
BTN_PREV  (via drill 0.25)
  Top 0.152: v0.64,89.41 0.64,12.83 BTN_PREV.P$1
  Bottom 0.152: BTN_PREV_ALT.P$1 2.7,91.47 v0.64,89.41 | BTN_PREV.P$1 13,0.46 61.67,0.46 74.76,13.55 74.76,24.17 73.98,24.96 71.83,24.96 71.6,25.19 71.6,26.67 71.78,26.86 IC1.15
BTN_RIGHT
  Bottom 0.152: BTN_RIGHT.P$1 46.44,11.68 47.16,12.41 55.89,12.41 70.84,27.36 70.84,28.52 71.71,29.4 IC1.13
BTN_SEL  (via drill 0.25)
  Top 0.152: BTN_SEL.P$1 51.82,7.87 v54.36,10.41
  Bottom 0.152: IC1.14 72.86,28.19 72.14,28.19 v54.36,10.41
BTN_UP
  Bottom 0.152: BTN_UP.P$1 46.95,13.21 47.16,12.99 55.99,12.99 70.52,27.52 70.52,29.48 71.73,30.69 72.91,30.69 IC1.12
EINK_BUSY  (via drill 0.25)
  Top 0.152: v38.1,68.33 21.59,84.84 v21.03,84.84 | v37.77,58.54 37.77,57.99 39.37,56.39 39.37,25.91 v37.59,24.13
  Bottom 0.152: U$2.9 19.9,85.96 v21.03,84.84 | v38.1,68.33 38.1,63.5 38,63.4 38,58.79 37.77,58.56 v37.77,58.54 | v37.59,24.13 EBSY.2
EINK_CS  (via drill 0.25)
  Top 0.152: v41.4,35.56 41.4,56.39 38.76,59.03 35.41,59.03 v35.31,58.93
  Bottom 0.152: U$2.12 16.39,84.46 14.99,83.06 14.99,80.26 18.42,76.83 18.42,75.82 v35.31,58.93 | ECS.1 42.42,34.29 41.4,35.31 v41.4,35.56
EINK_DC  (via drill 0.25)
  Top 0.152: v20.36,83.89 20.36,83.38 38.61,65.13 v38.61,63.25 | v38.43,58.54 38.43,58.34 40.39,56.39 v40.39,32.3
  Bottom 0.152: U$2.11 19.29,84.96 v20.36,83.89 | v38.61,63.25 38.43,63.07 v38.43,58.54 | v40.39,32.3 40.93,31.75 EDC.1
EINK_RESET  (via drill 0.25)
  Top 0.152: v20.33,84.6 20.59,84.6 37.11,68.07 v37.08,68.07 | v37.11,58.51 37.11,26.95 v36.83,26.67
  Bottom 0.152: U$2.10 19.47,85.46 v20.33,84.6 | v37.08,68.07 37.11,68.05 v37.11,58.51 | v36.83,26.67 ERST.2
EN  (via drill 0.25)
  Top 0.152: v56.39,15.49 58.93,12.95 SW1.P$2
  Bottom 0.152: EN.P$1 MS1.27 49.64,19.05 49.73,19.14 50.85,19.14 50.94,19.05 MS1.27' 56.26,15.49 v56.39,15.49
FEATHER_RX
  Bottom 0.152: RX.P$1 MS1.14 MS1.14'
FEATHER_TX
  Bottom 0.152: TX.P$1 MS1.15 28.08,41.91 27.99,41.82 26.87,41.82 26.78,41.91 MS1.15'
FLASH_CS
  Bottom 0.152: FCS.P$1 55.88,56.33 53.22,56.33 IC3.1
GDR  (via drill 0.25)
  Top 0.152: v33.02,78.23 21.73,89.52 v19.05,89.52
  Bottom 0.152: Q1.1 33.09,78.17 v33.02,78.23 | v19.05,89.52 17.97,89.52 U$2.2
GND  (via drill 0.25)
  Bottom 0.61: MS1.4' MS1.4 31.37,13.97 32.03,14.63 46.31,14.63 46.97,13.97 GND.P$1
  other vias: 13.97,70.1 65.53,78.49 16.76,81.53 76.55,1.35
  pour Bottom: 80.77,107.95 0.51,107.95 -2.29,105.16 -2.29,1.27 0.76,-1.78 77.98,-1.78 80.77,1.02
  pour Top: 83.31,106.17 80.01,109.47 -0.25,109.47 -4.06,105.66 -4.06,-3.03 81.81,-3.03 83.57,-1.27 83.57,105.66 81.53,107.7
GPIO_INT
  Bottom 0.305: IC1.8 56.82,31.88 55.84,32.85 38.19,32.85 INT.2
MISO  (via drill 0.25)
  Top 0.152: v29.46,58.21 28.71,58.21 v27.93,57.43
  Bottom 0.152: IC3.2 51.69,56.77 51.05,57.4 27.95,57.4 v27.93,57.43 27.3,56.81 IC2.2 27.3,50.42 23.37,46.48 23.37,37.85 24.38,36.83 MS1.13' MS1.13 MISO.P$1 | MICROSD.7 62.92,79.64 62.2,78.91 60.37,78.91 39.49,58.03 29.64,58.03 v29.46,58.21
MOSI  (via drill 0.25)
  Top 0.152: v16,81.03 16.26,81.03 23.96,73.32 v23.96,62.14 48.3,62.14 v49.15,62.99
  Bottom 0.152: MICROSD.3 58.73,75.24 49.15,65.66 v49.15,62.99 IC3.5 | U$2.14 16.79,83.46 16,82.67 v16,81.03 | v23.96,62.14 24.77,61.34 IC2.5 24.77,60.58 22.61,58.42 22.61,36.07 24.38,34.29 MS1.12' MS1.12 MOSI.P$1
N$1
  Bottom 0.305: R9.2 14.35,17.4 C6.1 8.51,17.4 R10.2
N$2
  Bottom 0.305: C9.2 46.87,79.07 D4.C 49.02,78.41 D5.A
N$3
  Bottom 0.305: C9.1 45.28,76.27 44.63,75.62 44.62,75.62 42.93,75.62 | Q1.3 36.95,77.22 L1.P$1 38.55,75.62 42.93,75.62 | D3.A 42.93,75.62
N$4
  Bottom 0.152: TP3.P$1 MS1.25 MS1.25'
N$5
  Bottom 0.152: MS1.24' MS1.24 TP2.P$1
N$6
  Bottom 0.152: TP1.P$1 MS1.23 MS1.23'
NC_D4
  Bottom 0.152: MS1.16' 26.78,44.45 26.87,44.54 27.99,44.54 28.08,44.45 MS1.16 XTRA.P$1
PREVGH
  Bottom 0.152: C16.2 24.38,79.5 23.93,79.96 U$2.21
PREVGL
  Bottom 0.152: C18.2 20.67,78.96 U$2.23
RESE  (via drill 0.25)
  Top 0.305: v19.47,88.99 32.26,76.2 v33.02,76.2
  Bottom 0.152: 35.81,74.42 34.04,76.2 33.95,76.2
  Bottom 0.305: U$2.3 19.45,88.96 v19.47,88.99 | v33.02,76.2 33.95,76.2 Q1.2 34.02,76.22 35.81,74.42 37.63,74.42 R5.1 R6.1
RESET
  Bottom 0.152: RST.P$1 29.97,6.35 | 29.97,6.35 MS1.1 28.08,6.35 27.99,6.26 26.87,6.26 26.78,6.35 MS1.1' | BTN_RESET.P$1 30.1,6.22 29.97,6.35
SCK  (via drill 0.25)
  Top 0.152: v15.49,80.52 22.73,73.28 v22.73,61.59
  Bottom 0.152: U$2.13 16.65,83.96 15.49,82.8 v15.49,80.52 | 39.73,57.73 28.82,57.73 26.04,60.51 IC2.6 26.04,62.36 25.65,62.74 23.88,62.74 v22.73,61.59 21.84,60.71 21.84,34.29 24.38,31.75 MS1.11' MS1.11 SCK.P$1 | 39.73,57.73 48.07,57.73 50.42,60.07 IC3.6 | MICROSD.5 71.35,77.19 59.19,77.19 39.73,57.73
SCL  (via drill 0.25)
  Top 0.152: v20.54,55.01 33.63,41.91 v35.81,41.91 | v56.13,41.91 56.13,29.21 v57.15,28.19
  Bottom 0.152: U$2.6 16.69,87.46 11.89,82.65 11.89,67.21 20.03,59.07 20.03,55.52 v20.54,55.01 19.68,54.15 I2C.4 | v35.81,41.91 SCL.P$1 MS1.18 49.64,41.91 49.73,41.82 50.85,41.82 50.94,41.91 MS1.18' v56.13,41.91 R4.2 | v57.15,28.19 57.23,28.19 62.45,22.97 63.7,22.97 IC1.1
SD_CD  (via drill 0.25)
  Top 0.152: v70.86,26.16 70.86,68.33 v70.36,68.83
  Bottom 0.152: IC1.17 71.73,24.29 70.86,25.15 v70.86,26.16 | v70.36,68.83 65.15,74.04 MICROSD.CD2
SD_CS
  Bottom 0.152: SDCS.1 43.18,40.06 43.52,40.4 60.21,40.4 73.15,53.34 73.15,72.91 71.92,74.14 MICROSD.2
SDA  (via drill 0.25)
  Top 0.152: v35.81,44.45 32.08,44.45 v20.52,56.01 19.34,56.01 v19,55.67 | v55.63,44.45 v55.63,30.99
  Bottom 0.152: R3.2 v55.63,44.45 MS1.17' 50.94,44.45 50.85,44.54 49.73,44.54 49.64,44.45 MS1.17 SDA.P$1 v35.81,44.45 | v20.52,56.01 20.52,59.06 12.19,67.39 12.19,82.53 16.64,86.97 16.64,86.96 U$2.7 | v19,55.67 18.42,55.1 12.36,55.1 11.31,56.15 I2C.3 | IC1.2 62.36,24.26 v55.63,30.99
SRAM_CS
  Bottom 0.152: IC2.1 28.58,51.94 35.31,45.21 35.31,40.13 38.61,36.83 SRCS.1
VBAT
  Bottom 0.61: MS1.28' 51.27,16.51 50.95,16.19 49.63,16.19 49.32,16.51 MS1.28 BAT.P$1
VBUS
  Bottom 0.61: MS1.26' MS1.26 USB.P$1
VCOM
  Bottom 0.152: C19.2 18.38,78.46 U$2.24
VDD
  Bottom 0.152: C13.2 19.3,81.46 U$2.18
VGH
  Bottom 0.152: C11.2 25.69,93.44 20.21,87.96 U$2.5
  Bottom 0.305: D3.C 39.95,82.04 C8.1 38.03,83.57 36.53,83.57 28.15,91.95 27.18,91.95 25.69,93.44
VGL
  Bottom 0.152: C10.2 25.56,96.11 23.11,93.66 23.11,91.95 19.63,88.46 U$2.4
  Bottom 0.305: D4.A 47.15,77.24 45.1,77.24 44.92,77.42 44.92,80.48 40.31,85.09 C7.1 29.91,94.74 26.92,94.74 25.56,96.11
VPP
  Bottom 0.152: C14.2 21.59,80.96 U$2.19
VSH
  Bottom 0.152: C15.2 23.89,80.46 U$2.20
VSL
  Bottom 0.152: C17.2 24.89,76.71 22.15,79.45 17.92,79.45 U$2.22

### Text on the board
tPlace: ``For years I have been coming to / this library, and I explore it / volume by volume, shelf by shelf, / but I could demonstrate to you / that I have done nothing but / continue the reading of a / single book.'' / - Italo Calvino | E-BOOK FEATHER WING | BTN_UP | BTN_LEFT | BTN_RIGHT | by / joey castillo / @josecastillo | BTN_PREV | BTN_SEL | BTN_NEXT | prototype board revision A | BTN_DOWN
bPlace: E-PAPER DISPLAY | MICROSD SLOT | 19 Power Supply for OTP Programming / 20 Positive Source driving voltage / 21 Power Supply pin for VGH and VSH / 22 Negative Source driving voltage / 23 Power Supply for VCOM, VGL & VSL / 24 VCOM driving voltage | >1 NC / 2 N-Channel MOSFET Gate Drive Control / 3 Current Sense Input for Control Loop / 4 Negative Gate driving voltage / 5 Positive Gate driving voltage / 6 I2C clock for temperature sensor / 7 I2C data for temperature sensor / 8 Bus selection pin (tied to GND) / 9 Busy state output pin / 10 Reset / 11 Data / Command control pin / 12 Chip Select input pin / 13 Serial clock pin (SPI) / 14 Serial data pin (SPI) / 15 Power for interface logic pins / 16 Power Supply for chip / 17 Ground / 18 Core logic power pin | A microSD card / interfaces with the / Feather mainboard / via the SPI interface / (MISO, MOSI, SCK, SDCS). / The card detect line is / available via the GPIO / expander's high bit. / / C2 is a filtering / capacitor for the SD / card's power supply. / <- This bit is / unrelated, just an / extra spot for a / `Next Page' button. | `Previous Page' button / (if you want it) -> | Left bit generates the / correct voltages to drive / the display. Right bit / smooths out the power / pins. Whole thing talks / over SPI + ECS / EDC pins. | GND | 3V | A2 | 32KB SRAM CHIP | 2MB FLASH CHIP | The 23K256-I/SN SRAM / chip provides a buffer / for the display. It uses / the SPI interface + SRCS. / / A B&W 400x300 display / requires 16000 bytes; if / you have that RAM to / spare, omit this chip (and C4). | If you're using a non-Express / board that lacks onboard Flash, / an optional GD25Q16CTIGR Flash / chip can hold the entire GNU / Unifont in its 2MB of memory. It / uses the SPI interface, but / you'll need to wire the FCS / pad to a spare GPIO. If you / skip this chip, omit filtering capacitor C5. | GND | 3V | SDA | SCL | GPIO EXPANDER | The MCP23008 provides eight / additional GPIO pins via the / I2C interface. It connects to / all buttons (except for RESET) / as well as the SD slot's / card detect signal. R3 / and R4 are the pull-up / resistors for SDA and / SCL, respectively. This chip / is required to use the buttons / unless you just want a few / wired directly to GPIO pads. / Capacitor C3 filters power. | GND | 3V | A1 | EXTRA PORTS | The center port / provides an I2C interface. / The other two ports provide / access to pins A1 and A2, / respectively. Diodes D1 and D2 / + resistors R1 and R2 provide / protection and current limiting. / Power to these ports is / filtered via capacitor C1. / This block is all very optional. | BTN_LEFT | BTN_DOWN | BTN_UP | BTN_RIGHT | Bits: / 0: LEFT / 1: DOWN / 2: UP / 3: RIGHT / 4: SEL / 5: PREV / 6: NEXT / 7: SD CD | BTN_SEL | BTN_PREV | BTN_NEXT | CARD DET | E-BOOK / FEATHER WING | HEADPHONE JACK | J1 is a mono jack fed / by the DAC on A0. | by joey castillo | Ferrite beads FB1 & FB2 / serve to isolate this / analog circuit from / the rest of the board. / This block is optional. | RESET | @josecastillo